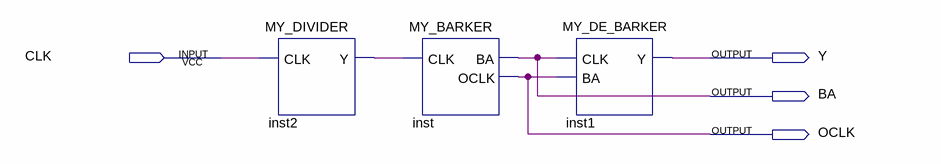
[diagram p0: schematic sheet]
// Quartus schematic TEST_DE_BARKER.bdf as structural Verilog: 3 symbols, 4 pins
module TEST_DE_BARKER (
  input  CLK,
  output Y,
  output BA,
  output OCLK
);

  wire inst2_y;

  MY_DIVIDER inst2 (.CLK(CLK), .Y(inst2_y));
  MY_BARKER inst (.CLK(inst2_y), .BA(BA), .OCLK(OCLK));
  MY_DE_BARKER inst1 (.CLK(BA), .BA(OCLK), .Y(Y));
endmodule
